# EAGLE design tempo_counter (EAGLE 7.6.0)
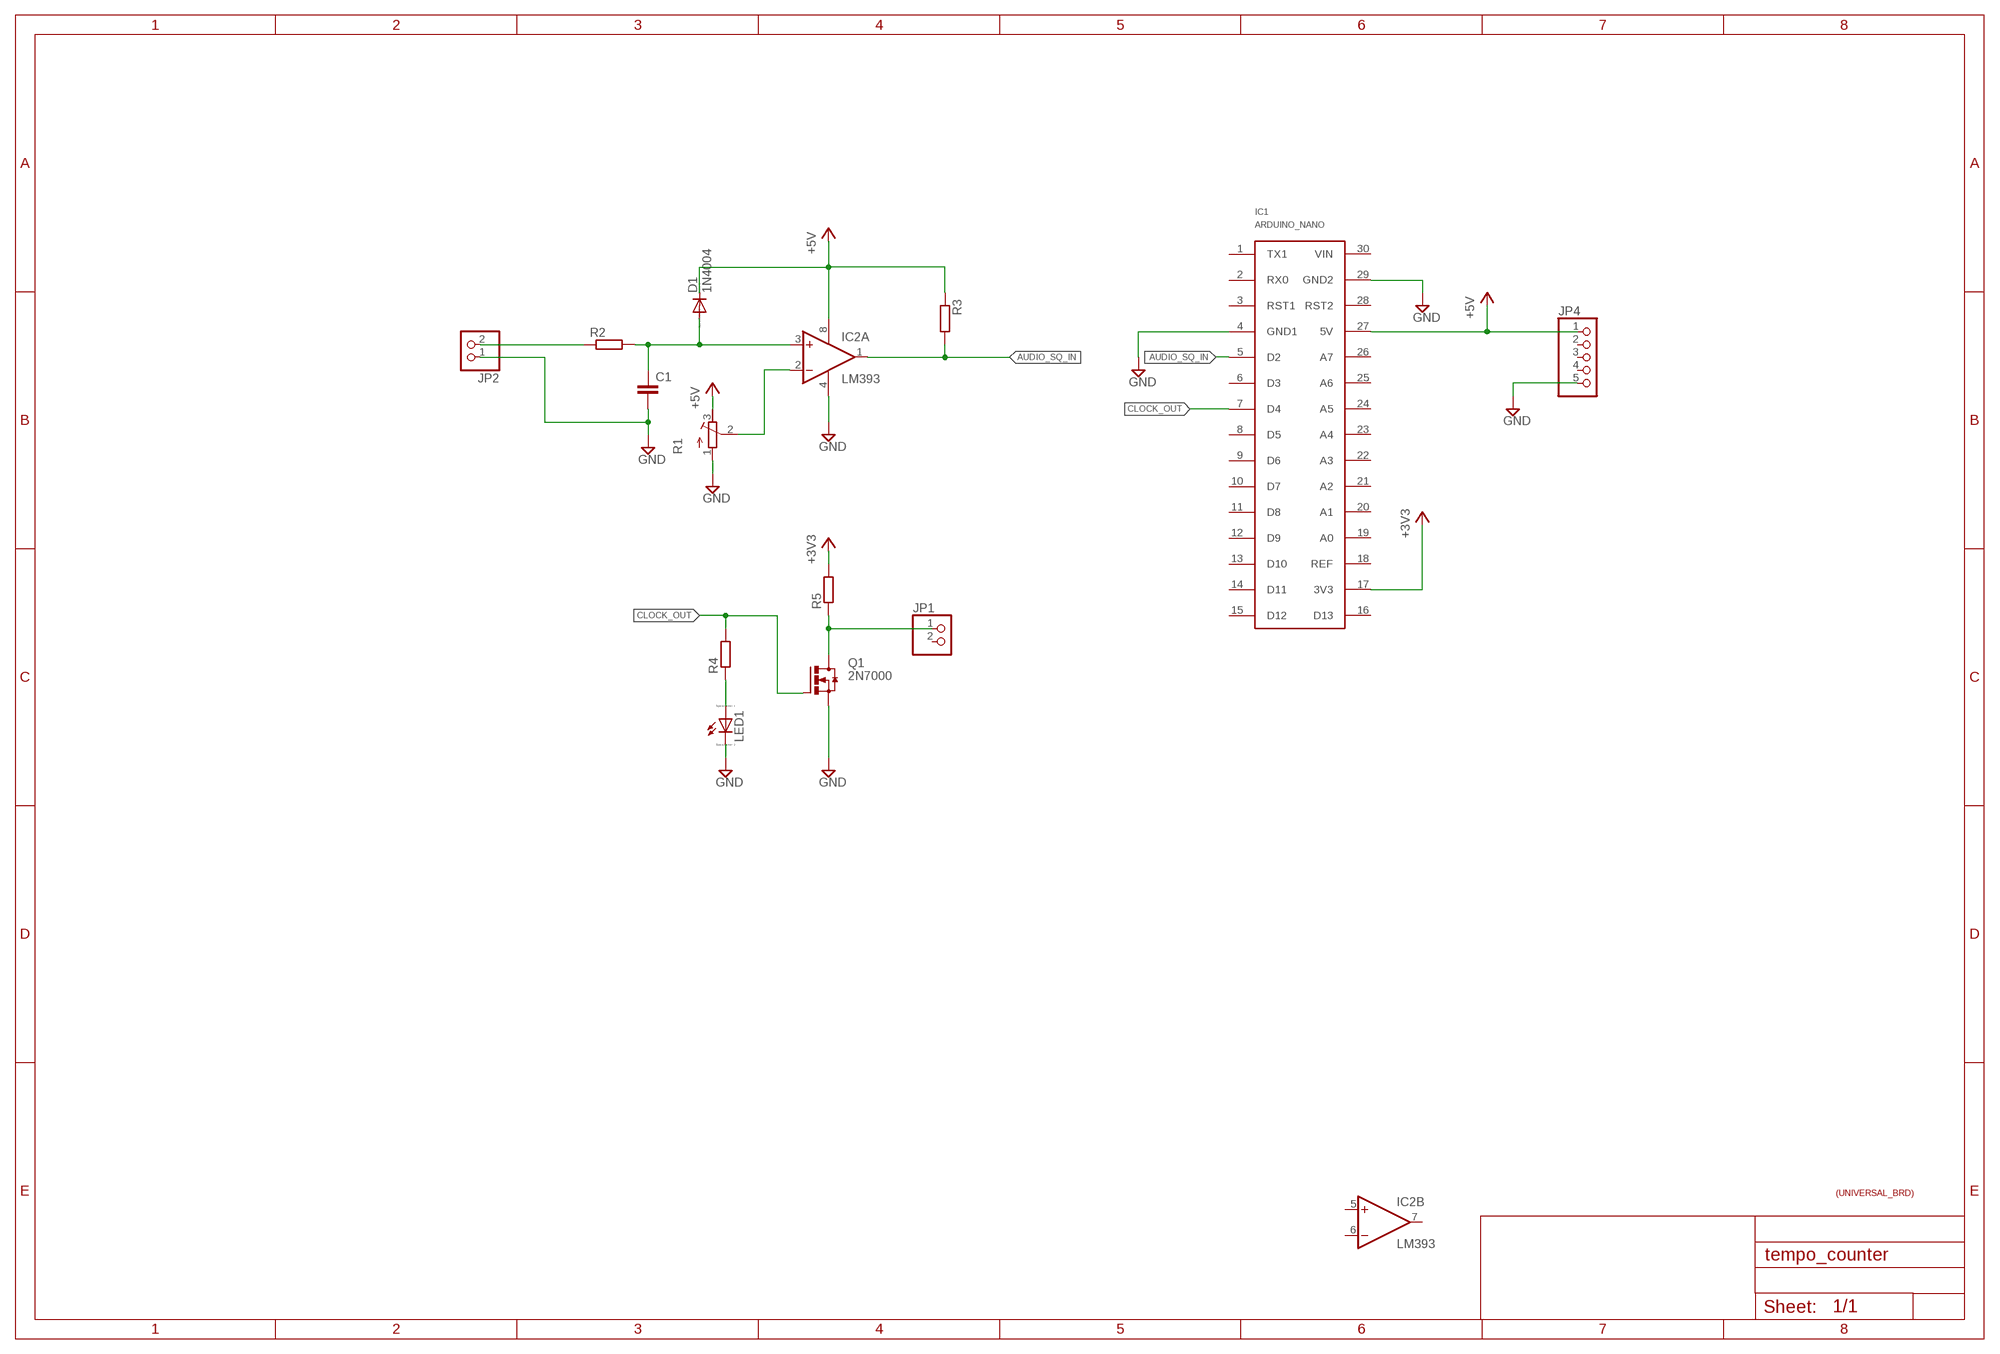
[diagram p0: schematic, sheet 1]

## Parts
C1  C_DIP_2.54_1  [C_DIP2.54_1]
D1  1N4004  [DO41-10]
IC1  ARDUINO_NANO  [ARDUINO_NANO]
IC2  LM393  [DIL08_UNIV]
JP1  PINHD-1X2  [1X02]
JP2  PINHD-1X2  [1X02]
JP4  PINHD-1X5  [1X05]
LED1  LED_ELD260  [LED_LD260]
Q1  2N7000  [TO92]
R1  R-TRIMM64W  [RTRIM64W]
R2  R_DIP_4  [R_DIP2.54_4]
R3  R_DIP_4  [R_DIP2.54_4]
R4  R_DIP_4  [R_DIP2.54_4]
R5  R_DIP_4  [R_DIP2.54_4]
U$1  UNIVERSAL_BRD_72MM_47MM  [UNIVERSAL_BRD_72MM_47MM_SMALL]

## Nets
+3V3: IC1.17(3V3) R5.2
+5V: D1.C IC1.27(5V) IC2.8(V+) JP4.1 R1.3(E) R3.1
AUDIO_SQ_IN: IC1.5(D2) IC2.1(A:OUT) R3.2
CLOCK_OUT: IC1.7(D4) Q1.G R4.2
GND: C1.2 IC1.4(GND1) IC1.29(GND2) IC2.4(V-) JP2.1 JP4.5 LED1.K(C) Q1.S R1.1(A)
N$1: JP2.2 R2.1
N$3: LED1.A R4.1
N$5: IC2.2(A:-IN) R1.2(S)
N$6: C1.1 D1.A IC2.3(A:+IN) R2.2
N$9: JP1.1 Q1.D R5.1
Unconnected: IC1.1(TX1) IC1.2(RX0) IC1.3(RST1) IC1.6(D3) IC1.8(D5) IC1.9(D6) IC1.10(D7) IC1.11(D8) IC1.12(D9) IC1.13(D10) IC1.14(D11) IC1.15(D12) IC1.16(D13) IC1.18(REF) IC1.19(A0) IC1.20(A1) IC1.21(A2) IC1.22(A3) IC1.23(A4) IC1.24(A5) IC1.25(A6) IC1.26(A7) IC1.28(RST2) IC1.30(VIN) IC2.5(B:+IN) IC2.6(B:-IN) IC2.7(B:OUT) JP1.2 JP4.2 JP4.3 JP4.4

## Library data of the parts
C1 = shozaburo_rcl:C: s means small package
D1 = diode:1N4004: DIODE general purpose rectifier, 1 A
IC1 = shozaburo_ic:ARDUINO_NANO: Arduino Board
IC2 = shozaburo_ic:LM393
JP1 JP2 = shozaburo_pinhead:PINHD-1X2: PIN HEADER
JP4 = shozaburo_pinhead:PINHD-1X5: PIN HEADER
LED1 = eagle-ltspice:LED_E: LED Source: http://www.osram.convergy.de Source: www.luxeon.com Source: www.kingbright.com; SPICEMODEL: NONE; SPICEPREFIX: D; SPICETYPE: diode
Q1 = shozaburo_mosfet:2N7000
R1 = resistor:R-TRIMM: Trimm resistor
R2-R5 = shozaburo_rcl:R
U$1 = shozaburo_brd_template:UNIVERSAL_BRD_72MM_47MM

## Board
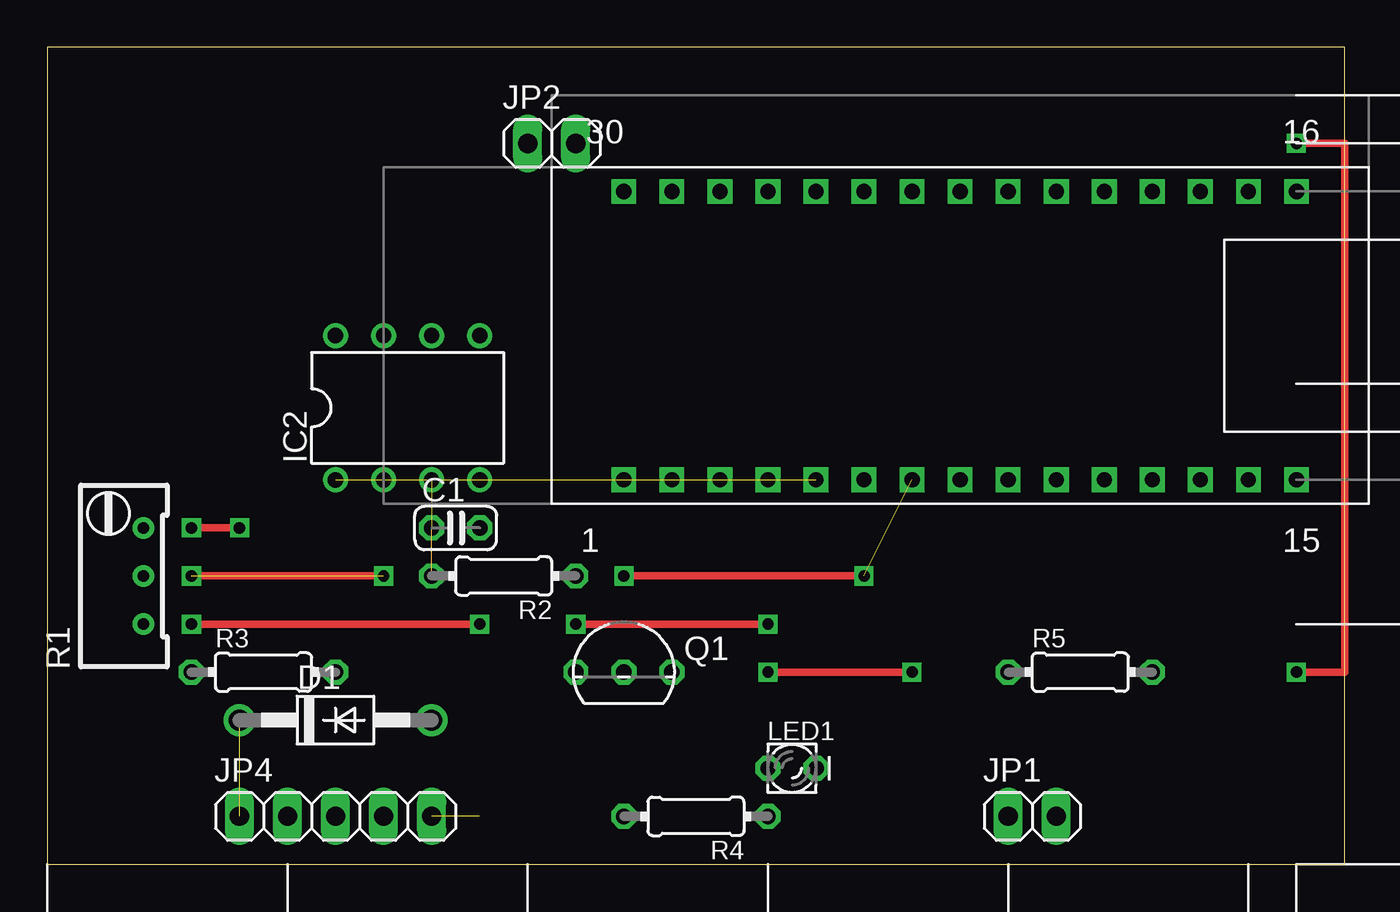
[diagram p1: board, top side]
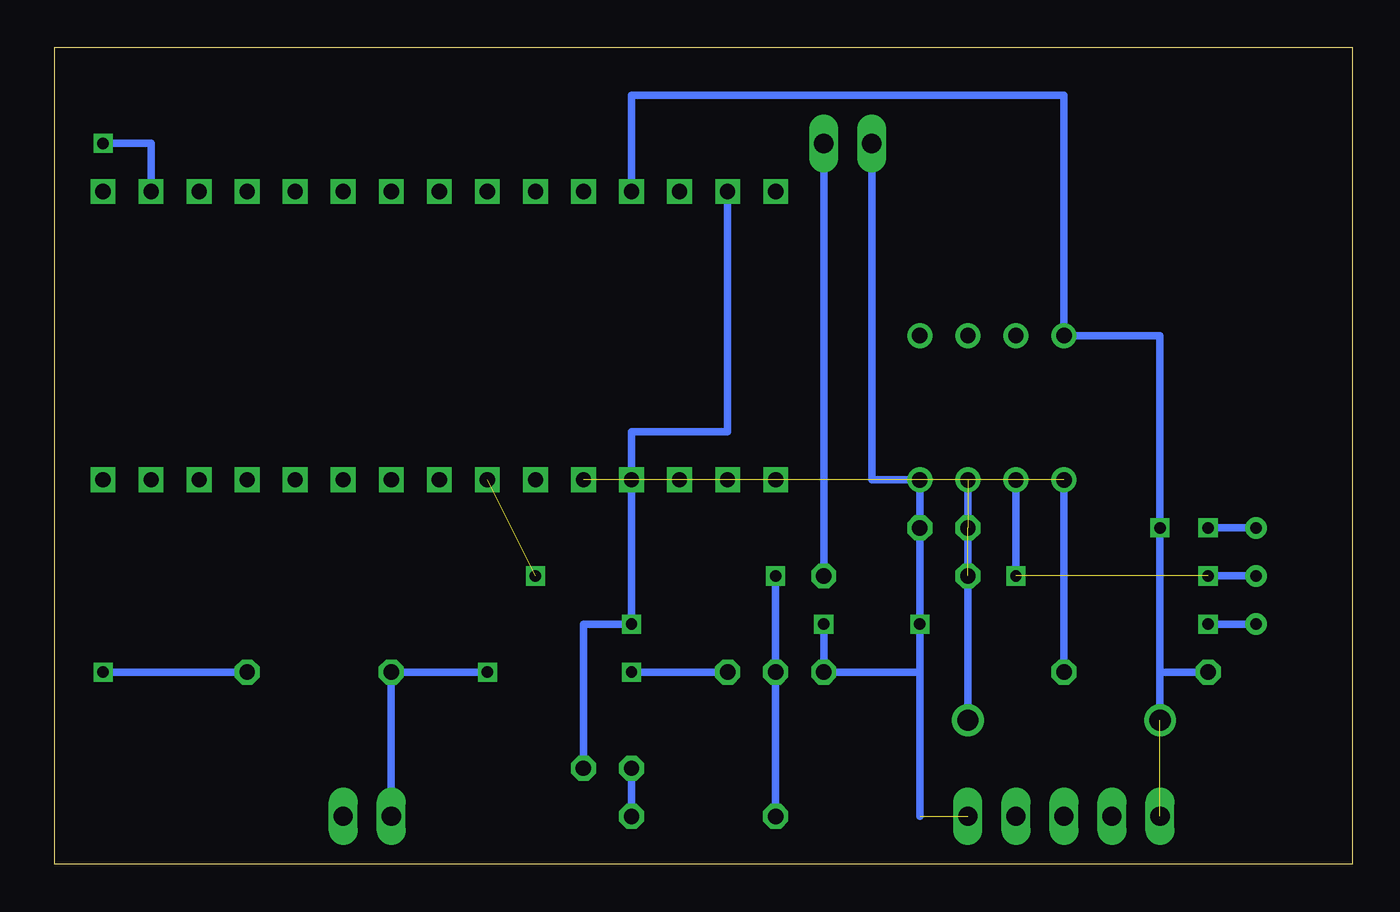
[diagram p2: board, bottom side, seen from below]

Size 68.58 x 43.18 mm. Coordinates in mm from the lower left corner, seen from the top.
Outline: 0,0 68.58,0 68.58,43.18 0,43.17 0,0
Copper layers (1*16): Top 0.035mm / dielectric 1.5mm / Bottom 0.035mm
Design rules "default": minimum track width 10mil, minimum drill 24mil, track to track 8mil, track to pad 8mil, pad to pad 8mil, via to via 8mil, smd to smd 8mil, copper to edge 40mil, drill to drill 8mil, minimum pad ring 10mil, minimum via ring 8mil, stop-mask expansion 4mil, vias tented up to drill 0mil, thermal gap 10mil

### Footprints (pad centres in the part's own frame; a part is rotated, then mirrored left to right if it is on the bottom)
C_DIP2.54_1 = drill 0.813 octagon: 1 -1.27,0; 2 1.27,0
DO41-10 = drill 1.118: A 5.08,0; C -5.08,0
ARDUINO_NANO = drill 0.8 square: 1 19.05,7.62; 2 16.51,7.62; 3 13.97,7.62; 4 11.43,7.62; 5 8.89,7.62; 6 6.35,7.62; 7 3.81,7.62; 8 1.27,7.62; 9 -1.27,7.62; 10 -3.81,7.62; 11 -6.35,7.62; 12 -8.89,7.62; 13 -11.43,7.62; 14 -13.97,7.62; 15 -16.51,7.62; 16 -16.51,-7.62; 17 -13.97,-7.62; 18 -11.43,-7.62; 19 -8.89,-7.62; 20 -6.35,-7.62; 21 -3.81,-7.62; 22 -1.27,-7.62; 23 1.27,-7.62; 24 3.81,-7.62; 25 6.35,-7.62; 26 8.89,-7.62; 27 11.43,-7.62; 28 13.97,-7.62; 29 16.51,-7.62; 30 19.05,-7.62
DIL08_UNIV = drill 0.813 pad 1.27: 1 -3.81,-3.81; 2 -1.27,-3.81; 3 1.27,-3.81; 4 3.81,-3.81; 5 3.81,3.81; 6 1.27,3.81; 7 -1.27,3.81; 8 -3.81,3.81
1X02 = drill 1.016 long: 1 -1.27,0; 2 1.27,0
1X05 = drill 1.016 long: 1 -5.08,0; 2 -2.54,0; 3 0,0; 4 2.54,0; 5 5.08,0
LED_LD260 = drill 0.813 octagon: A -1.27,0; K 1.27,0
TO92 = drill 0.813 octagon: D 2.54,0; G 0,0; S -2.54,0
RTRIM64W = drill 0.61: 1 1.27,-2.54; 2 1.27,0; 3 1.27,2.54
R_DIP2.54_4 = drill 0.813 octagon: 1 -3.81,0; 2 3.81,0

### Placement (x,y rotation side)
C1  21.59,17.78 0 top
D1  15.24,7.62 0 top
IC1  49.53,27.94 180 top
IC2  19.05,24.13 0 top
JP1  52.07,2.54 0 top
JP2  26.67,38.1 0 top
JP4  15.24,2.54 0 top
LED1  39.37,5.08 0 top
Q1  30.48,10.16 0 top
R1  3.81,15.24 0 top
R2  24.13,15.24 180 top
R3  11.43,10.16 0 top
R4  34.29,2.54 180 top
R5  54.61,10.16 0 top
U$1  0,0 0 top

### Tracks (layer width: path | path; a pad name or v marks a point on that pad's centre or on a via)
+3V3  (via drill 0.6)
  Top 0.406: v66.04,10.16 68.58,10.16 68.58,38.1 v66.04,38.1
  Bottom 0.406: R5.2 v66.04,10.16 | IC1.17 63.5,38.1 v66.04,38.1
+5V  (via drill 0.6)  (1 unrouted)
  Top 0.406: v7.62,17.78 v10.16,17.78
  Bottom 0.406: D1.C 10.16,10.16 | 10.16,10.16 v10.16,17.78 10.16,27.94 IC2.8 15.24,40.64 38.1,40.64 IC1.27 | R3.1 10.16,10.16 | R1.3 v7.62,17.78
AUDIO_SQ_IN  (1 unrouted)
  Bottom 0.406: IC2.1 R3.2
CLOCK_OUT  (via drill 0.6)  (1 unrouted)
  Top 0.406: v30.48,15.24 v43.18,15.24
  Bottom 0.406: R4.2 Q1.G v30.48,15.24
GND  (via drill 0.6)  (1 unrouted)
  Top 0.406: v7.62,12.7 v22.86,12.7 | v27.94,12.7 v38.1,12.7
  Bottom 0.406: 22.86,10.16 v22.86,12.7 C1.2 IC2.4 25.4,20.32 JP2.1 | 22.86,10.16 Q1.S v27.94,12.7 | 22.86,10.16 22.86,2.54 | R1.1 v7.62,12.7 | IC1.29 33.02,22.86 38.1,22.86 IC1.4 v38.1,12.7 40.64,12.7 LED1.K
N$1
  Bottom 0.406: JP2.2 R2.1
N$3
  Bottom 0.406: LED1.A R4.1
N$5  (1 unrouted)
  Bottom 0.406: R1.2 7.62,15.24 | IC2.2 17.78,15.24
N$6  (2 unrouted)
  Bottom 0.406: IC2.3 D1.A
N$7  (via drill 0.6)
  other vias: 17.78,15.24
N$8  (via drill 0.6)
  Top 0.406: v7.62,15.24 17.78,15.24
N$9  (via drill 0.6)
  Top 0.406: v38.1,10.16 v45.72,10.16
  Bottom 0.406: Q1.D v38.1,10.16 | v45.72,10.16 R5.1 JP1.1